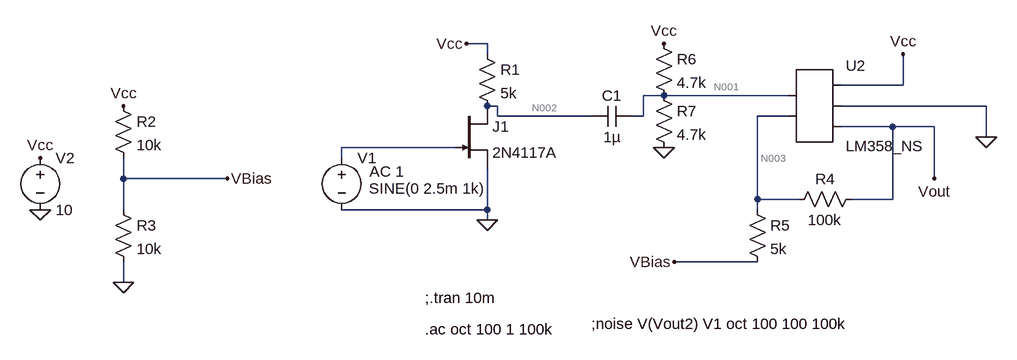
[diagram p0: schematic Building_Preamp_2_LM358_nonInv.asc]
* Building_Preamp_2_LM358_nonInv.asc
V1 N004 0 SINE(0 2.5m 1k) AC 1
V2 Vcc 0 10
R1 Vcc N002 5k
C1 N001 N002 1µ
J1 N002 N004 0 2N4117A
R2 Vcc VBias 10k
R3 VBias 0 10k
* U2: LM358_NS (symbol AutoGenerated\LM358_NS not available, pins judged from their places): pin1=N001 pin2=N003 pin3=Vcc pin4=0 pin5=Vout
R5 N003 VBias 5k
R6 Vcc N001 4.7k
R7 N001 0 4.7k
R4 Vout N003 100k
.model NJF NJF
.model PJF PJF
.lib standard.jft
;.tran 10m
;noise V(Vout2) V1 oct 100 100 100k
.ac oct 100 1 100k
.backanno
.end

* Results of the author's LTspice run, read from the files saved beside the schematic
* Operating Point, zero values left out:
*   V(vcc) = 10 V
*   V(n002) = 5.737 V
*   V(n001) = 5 V
*   V(vbias) = 5.001 V
*   V(n003) = 5.002 V
*   V(vout) = 5.02 V
*   Id(J1) = 852.5 µA
*   Ig(J1) = -5.843 pA
*   Is(J1) = -852.5 µA
*   I(R4) = 174.2 nA
*   I(R7) = 1.064 mA
*   I(R6) = 1.064 mA
*   I(R5) = 212.2 nA
*   I(R3) = 500.1 µA
*   I(R2) = 499.9 µA
*   I(R1) = 852.5 µA
*   I(V2) = -2.412 mA
*   I(V1) = 5.843 pA
*   Ix(u2:1) = -51.96 nA
*   Ix(u2:2) = -37.96 nA
*   Ix(u2:99) = -4.649 µA
*   Ix(u2:50) = 4.913 µA
*   Ix(u2:28) = -174.2 nA
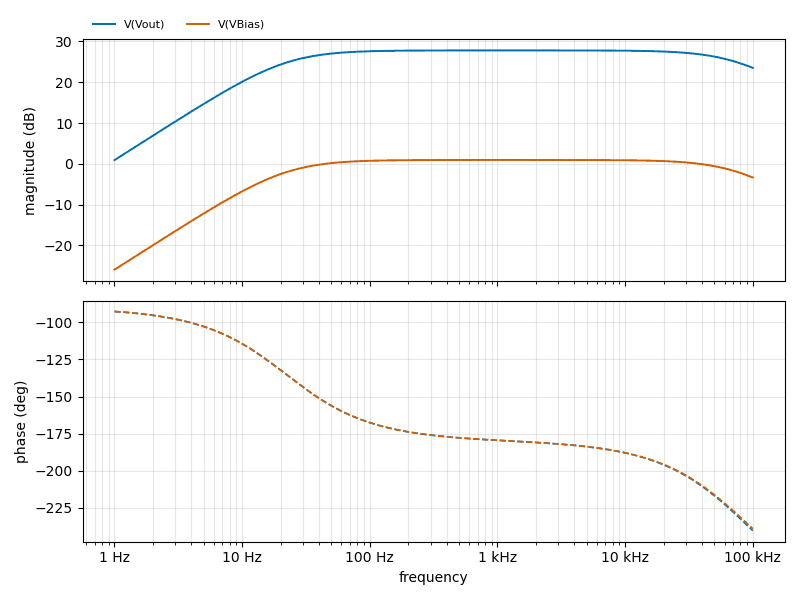
[diagram p1: AC Analysis of Building_Preamp_2_LM358_nonInv.asc, plotted from the saved traces]
* AC Analysis, 1 run:
*   V(Vout): 0.90 dB at 1 Hz, 23.50 dB at 100 kHz, peak 27.80 dB at 1.305 kHz, 3 dB below the peak at 22.09 Hz and 77.08 kHz
*   V(VBias): -25.95 dB at 1 Hz, -3.38 dB at 100 kHz, peak 0.95 dB at 1.305 kHz, 3 dB below the peak at 22.09 Hz and 76.82 kHz